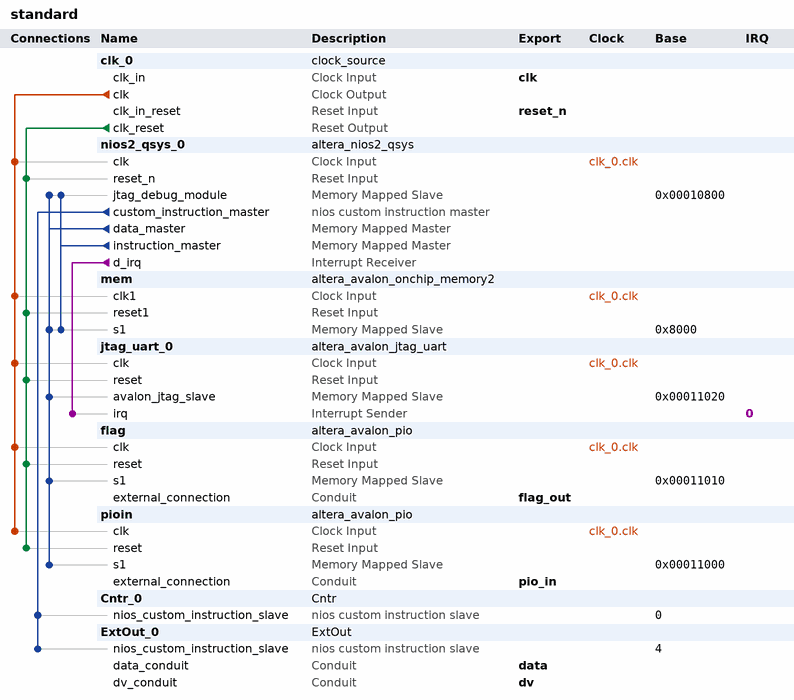
[diagram p0: system contents]
# Platform Designer (Qsys) system standard, Cyclone III EP3C25F324C6
# Parameters at their usual value, and those the tool derives, are not listed.
package require -exact qsys 13.1
create_system standard
set_project_property DEVICE_FAMILY {Cyclone III}
set_project_property DEVICE EP3C25F324C6

add_instance clk_0 clock_source 13.1
set_instance_parameter_value clk_0 clockFrequency 50000000

add_instance nios2_qsys_0 altera_nios2_qsys 13.1
set_instance_parameter_value nios2_qsys_0 resetSlave mem.s1
set_instance_parameter_value nios2_qsys_0 mmu_TLBMissExcSlave None
set_instance_parameter_value nios2_qsys_0 exceptionSlave mem.s1
set_instance_parameter_value nios2_qsys_0 breakSlave nios2_qsys_0.jtag_debug_module
set_instance_parameter_value nios2_qsys_0 impl Fast
set_instance_parameter_value nios2_qsys_0 icache_size 1024
set_instance_parameter_value nios2_qsys_0 dcache_size 1024

add_instance mem altera_avalon_onchip_memory2 13.1
set_instance_parameter_value mem dataWidth 32
set_instance_parameter_value mem dualPort false
set_instance_parameter_value mem initMemContent true
set_instance_parameter_value mem initializationFileName onchip_mem.hex
set_instance_parameter_value mem memorySize 32768

add_instance jtag_uart_0 altera_avalon_jtag_uart 13.1
set_instance_parameter_value jtag_uart_0 simInteractiveOptions NO_INTERACTIVE_WINDOWS

add_instance flag altera_avalon_pio 13.1
set_instance_parameter_value flag direction Output
set_instance_parameter_value flag width 1

add_instance pioin altera_avalon_pio 13.1
set_instance_parameter_value pioin captureEdge true
set_instance_parameter_value pioin direction Input
set_instance_parameter_value pioin width 1

add_instance Cntr_0 Cntr 1.0

add_instance ExtOut_0 ExtOut 1.0

# connections
add_connection clk_0.clk flag.clk clock
add_connection clk_0.clk jtag_uart_0.clk clock
add_connection clk_0.clk mem.clk1 clock
add_connection clk_0.clk nios2_qsys_0.clk clock
add_connection clk_0.clk pioin.clk clock
add_connection clk_0.clk_reset flag.reset reset
add_connection clk_0.clk_reset jtag_uart_0.reset reset
add_connection clk_0.clk_reset mem.reset1 reset
add_connection clk_0.clk_reset nios2_qsys_0.reset_n reset
add_connection clk_0.clk_reset pioin.reset reset
add_connection nios2_qsys_0.data_master flag.s1 avalon
set_connection_parameter_value nios2_qsys_0.data_master/flag.s1 baseAddress 0x00011010
add_connection nios2_qsys_0.data_master jtag_uart_0.avalon_jtag_slave avalon
set_connection_parameter_value nios2_qsys_0.data_master/jtag_uart_0.avalon_jtag_slave baseAddress 0x00011020
add_connection nios2_qsys_0.data_master mem.s1 avalon
set_connection_parameter_value nios2_qsys_0.data_master/mem.s1 baseAddress 0x8000
add_connection nios2_qsys_0.data_master nios2_qsys_0.jtag_debug_module avalon
set_connection_parameter_value nios2_qsys_0.data_master/nios2_qsys_0.jtag_debug_module baseAddress 0x00010800
add_connection nios2_qsys_0.data_master pioin.s1 avalon
set_connection_parameter_value nios2_qsys_0.data_master/pioin.s1 baseAddress 0x00011000
add_connection nios2_qsys_0.instruction_master mem.s1 avalon
set_connection_parameter_value nios2_qsys_0.instruction_master/mem.s1 baseAddress 0x8000
add_connection nios2_qsys_0.instruction_master nios2_qsys_0.jtag_debug_module avalon
set_connection_parameter_value nios2_qsys_0.instruction_master/nios2_qsys_0.jtag_debug_module baseAddress 0x00010800
add_connection nios2_qsys_0.d_irq jtag_uart_0.irq interrupt
set_connection_parameter_value nios2_qsys_0.d_irq/jtag_uart_0.irq irqNumber 0
add_connection nios2_qsys_0.custom_instruction_master Cntr_0.nios_custom_instruction_slave nios_custom_instruction
set_connection_parameter_value nios2_qsys_0.custom_instruction_master/Cntr_0.nios_custom_instruction_slave CIName cntr_0
set_connection_parameter_value nios2_qsys_0.custom_instruction_master/Cntr_0.nios_custom_instruction_slave baseAddress 0
add_connection nios2_qsys_0.custom_instruction_master ExtOut_0.nios_custom_instruction_slave nios_custom_instruction
set_connection_parameter_value nios2_qsys_0.custom_instruction_master/ExtOut_0.nios_custom_instruction_slave CIName extout_0
set_connection_parameter_value nios2_qsys_0.custom_instruction_master/ExtOut_0.nios_custom_instruction_slave baseAddress 4

# exported interfaces
add_interface clk clock sink
set_interface_property clk EXPORT_OF clk_0.clk_in
add_interface reset_n reset sink
set_interface_property reset_n EXPORT_OF clk_0.clk_in_reset
add_interface flag_out conduit end
set_interface_property flag_out EXPORT_OF flag.external_connection
add_interface pio_in conduit end
set_interface_property pio_in EXPORT_OF pioin.external_connection
add_interface data conduit end
set_interface_property data EXPORT_OF ExtOut_0.data_conduit
add_interface dv conduit end
set_interface_property dv EXPORT_OF ExtOut_0.dv_conduit

set_interconnect_requirement {$system} qsys_mm.clockCrossingAdapter HANDSHAKE
set_interconnect_requirement {$system} qsys_mm.maxAdditionalLatency 1
set_interconnect_requirement {$system} qsys_mm.insertDefaultSlave false

save_system standard.qsys
